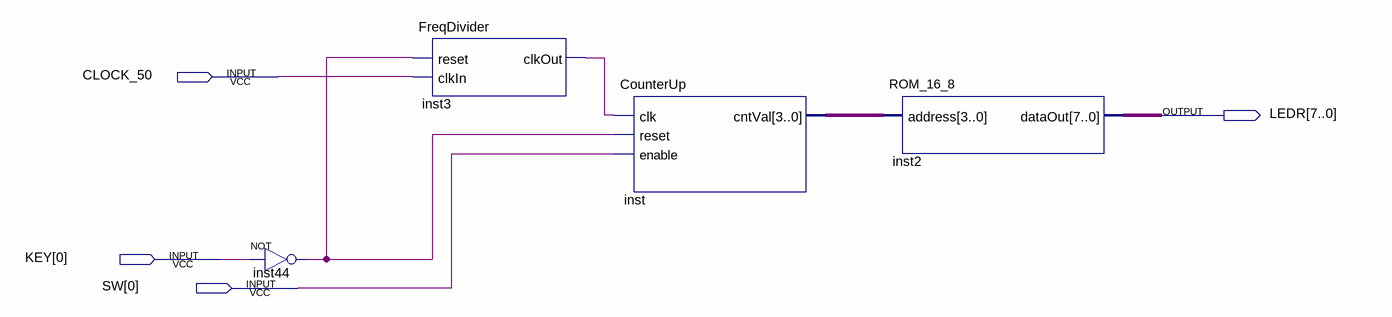
[diagram p0: schematic sheet]
// Quartus schematic ROM_Demo.bdf as structural Verilog: 4 symbols, 4 pins
module ROM_Demo (
  input  CLOCK_50,
  input  [0:0] KEY,
  input  [0:0] SW,
  output [7:0] LEDR
);

  wire inst3_clkout, inst44_out;
  wire [3:0] inst_cntval;

  not inst44 (inst44_out, KEY[0]);
  FreqDivider inst3 (.reset(inst44_out), .clkIn(CLOCK_50), .clkOut(inst3_clkout));
  CounterUp inst (.clk(inst3_clkout), .reset(inst44_out), .enable(SW[0]), .cntVal(inst_cntval));
  ROM_16_8 inst2 (.address(inst_cntval), .dataOut(LEDR));
endmodule
